# EAGLE design DKBLE11x-OTA-AddOn-0_1 (EAGLE 6.4)
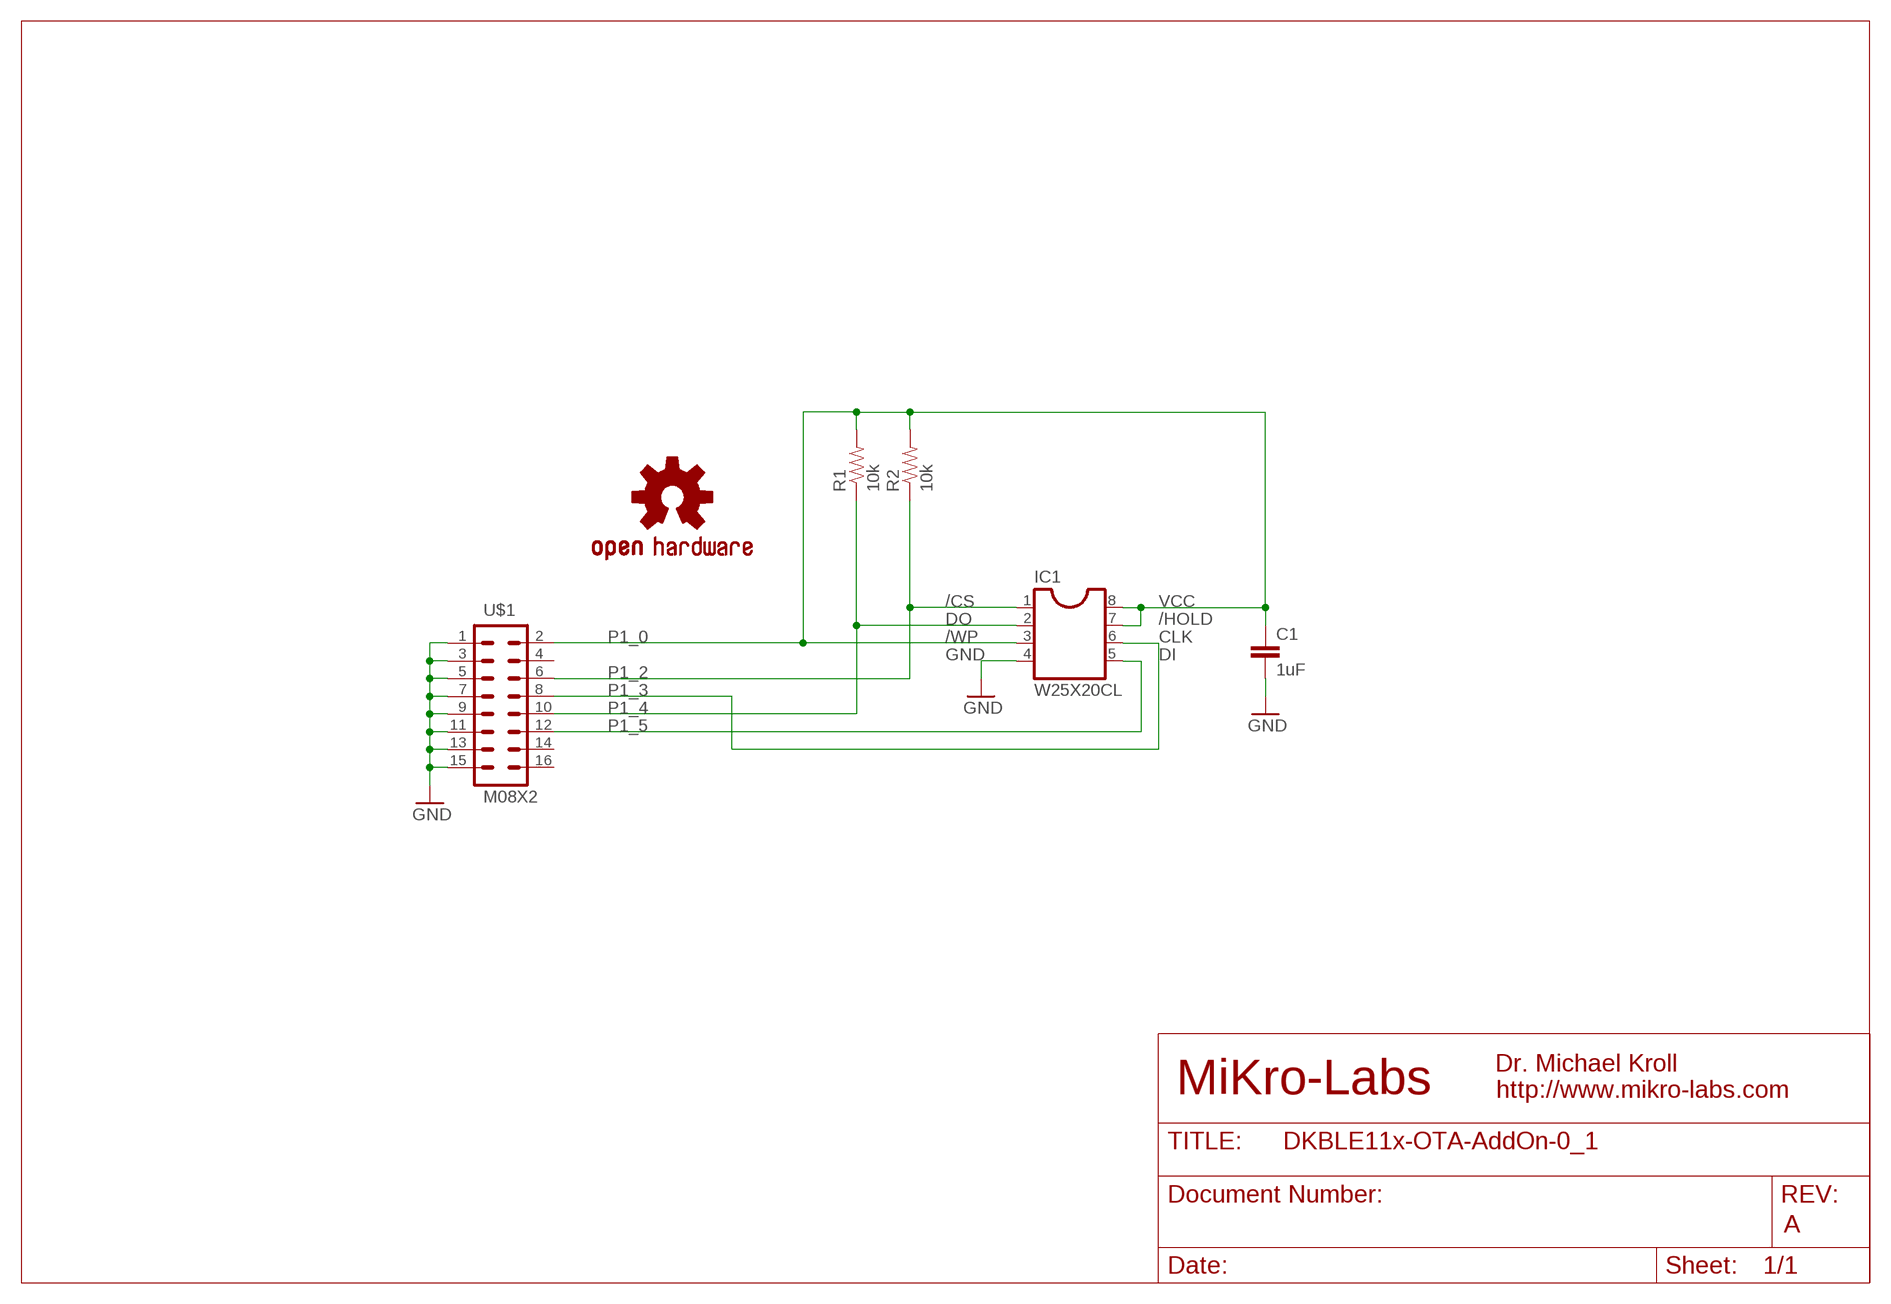
[diagram p0: schematic, sheet 1]

## Parts
C1  1uF  CAP0603-CAP  [0603-CAP]
IC1  W25X20CL  IC_DIL8-SOIC8  [SO-8]
LOGO1  OSHW-LOGOS  [OSHW-LOGO-S]
R1  10k  RESISTOR0603-RES  [0603-RES]
R2  10k  RESISTOR0603-RES  [0603-RES]
U$1  M08X2  [2X8]

## Nets
/HOLD: C1.1 IC1.3 IC1.7 IC1.8 R1.2 R2.2 U$1.2
CLK: IC1.6 U$1.8
DI: IC1.5 U$1.12
DO: IC1.2 R1.1 U$1.10
GND: C1.2 IC1.4 U$1.1 U$1.3 U$1.5 U$1.7 U$1.9 U$1.11 U$1.13 U$1.15
P1_2: IC1.1 R2.1 U$1.6
Unconnected: U$1.4 U$1.14 U$1.16

## Notes on the sheet
- /CS | VCC
- DO | /HOLD
- P1_0 | /WP | CLK
- GND | DI
- P1_2
- P1_3
- P1_4
- P1_5
- Dr. Michael Kroll
- MiKro-Labs | http://www.mikro-labs.com
- A

## Library data of the parts
C1 = SparkFun-Capacitors:CAP: Capacitor Standard 0603 ceramic capacitor, and 0.1" leaded capacitor.
IC1 = dp_devices:IC_DIL8: Universal 8pins IC
LOGO1 = SparkFun-Aesthetics:OSHW-LOGO: Open Source Hardware Logo This logo indicates the piece of hardware it is found on incorporates a OSHW license and/or adheres to the definition of open source hardware found here: http://freedomdefined.org/OSHW
R1 R2 = SparkFun-Resistors:RESISTOR: Resistor Basic schematic elements and footprints for 0603, 1206, and PTH resistors.
U$1 = SparkFun-Connectors:M08X2: .1" headers, two rows of 8 each

## Board
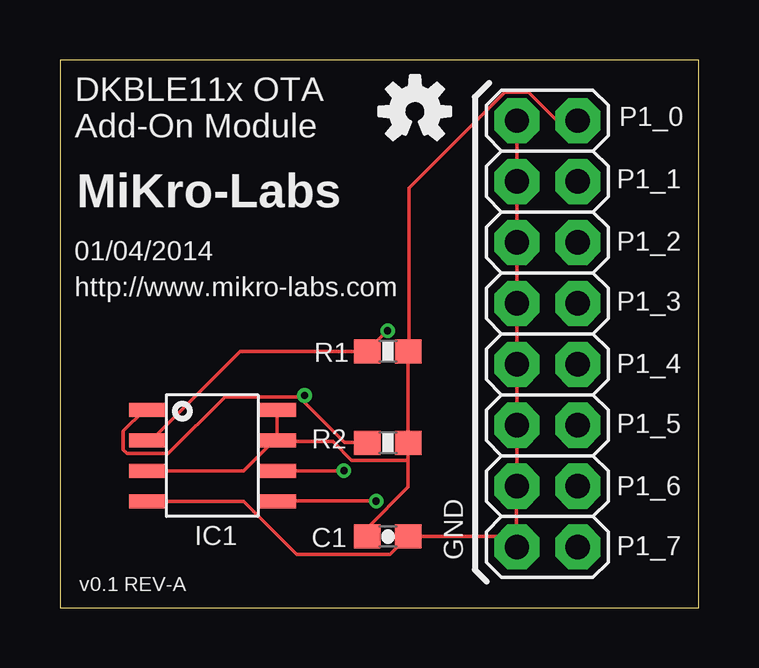
[diagram p1: board, top side]
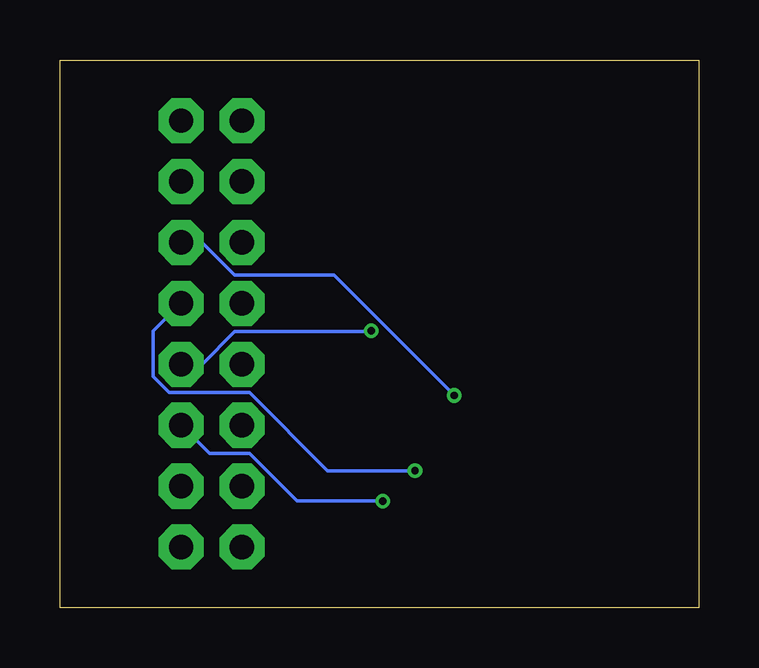
[diagram p2: board, bottom side, seen from below]

Size 26.64 x 22.85 mm. Coordinates in mm from the lower left corner, seen from the top.
Outline: 0,0 26.64,0 26.64,22.85 0,22.85 0,0
Copper layers (1*2*15*16): Top 0.035mm / dielectric 0.2mm / layer 2 0.0175mm / dielectric 1.1mm / layer 15 0.0175mm / dielectric 0.2mm / Bottom 0.035mm
Design rules "SeeedStudio_DRU_no_angle_20130527": minimum track width 6mil, minimum drill 12mil, track to track 6mil, track to pad 6mil, pad to pad 6mil, via to via 6mil, smd to smd 0mil, copper to edge 10mil, drill to drill 10mil, minimum pad ring 6mil, minimum via ring 6mil, stop-mask expansion 2mil, vias tented up to drill 25mil, thermal gap 10mil

### Footprints (pad centres in the part's own frame; a part is rotated, then mirrored left to right if it is on the bottom)
0603-CAP = smd 1.1 x 1: 1 -0.85,0; 2 0.85,0
SO-8 = smd 0.6 x 1.55: 1 -1.905,-2.69; 2 -0.635,-2.69; 3 0.635,-2.69; 4 1.905,-2.69; 5 1.905,2.71; 6 0.635,2.71; 7 -0.635,2.71; 8 -1.905,2.71
0603-RES = smd 1.1 x 1: 1 -0.85,0; 2 0.85,0
2X8 = drill 1.016 pad 1.88 octagon: 1 0,0; 2 0,2.54; 3 2.54,0; 4 2.54,2.54; 5 5.08,0; 6 5.08,2.54; 7 7.62,0; 8 7.62,2.54; 9 10.16,0; 10 10.16,2.54; 11 12.7,0; 12 12.7,2.54; 13 15.24,0; 14 15.24,2.54; 15 17.78,0; 16 17.78,2.54

### Placement (x,y rotation side)
C1  13.67,2.98 0 top
IC1  6.35,6.35 270 top
LOGO1  14.8,20.7 0 top
R1  13.67,10.7 0 top
R2  13.67,6.89 0 top
U$1  19.05,20.32 270 top

### Tracks (layer width: path | path; a pad name or v marks a point on that pad's centre or on a via)
/HOLD
  Top 0.152: IC1.3 7.66,5.72 8.92,6.98 IC1.7 | IC1.7 IC1.8 | C1.1 12.82,3.34 14.52,5.04 14.52,6.16 | 14.52,6.16 R2.2 R1.2 14.56,10.76 14.56,17.5 18.56,21.5 19.54,21.5 20.72,20.32 U$1.2 | 14.52,6.16 12.16,6.16 11.38,6.94 9.12,6.94 IC1.7
CLK  (via drill 0.3)
  Top 0.152: v11.84,5.72 IC1.6
  Bottom 0.152: v11.84,5.72 15.48,5.72 18.74,8.98 22.08,8.98 22.76,9.66 22.76,11.54 U$1.8
DI  (via drill 0.3)
  Top 0.152: v13.18,4.46 9.06,4.46 IC1.5
  Bottom 0.152: v13.18,4.46 16.76,4.46 18.74,6.44 20.4,6.44 U$1.12
DO  (via drill 0.3)
  Top 0.152: IC1.2 3.66,7 3.82,7 7.52,10.7 R1.1 12.86,10.76 v13.66,11.56
  Bottom 0.152: U$1.10 20.72,10.16 19.36,11.52 13.7,11.52 v13.66,11.56
GND
  Top 0.152: IC1.4 7.66,4.44 9.86,2.24 13.76,2.24 14.46,2.94 C1.2 18.6,2.98 U$1.15 19.04,2.64 U$1.13 19.06,5.14 U$1.11 19.06,7.68 U$1.9 19.06,10.22 U$1.7 19.06,12.76 U$1.5 19.06,15.3 U$1.3 19.06,17.84 U$1.1
P1_2  (via drill 0.3)
  Top 0.152: 10.05,8.71 9.96,8.8 6.88,8.8 4.52,6.44 2.8,6.44 2.64,6.6 2.64,7.38 3.5,8.24 IC1.1 | 10.05,8.71 11.86,6.9 R2.1 | 10.05,8.71 v10.2,8.86
  Bottom 0.152: U$1.6 20.72,15.24 19.36,13.88 15.22,13.88 v10.2,8.86

### Text on the board
tNames: DKBLE11x OTA / Add-On Module | P1_0 | P1_1 | MiKro-Labs | P1_2 | 01/04/2014 | http://www.mikro-labs.com | P1_3 | P1_4 | P1_5 | P1_6 | GND | P1_7 | v0.1 REV-A